# Altium schematic sheet Optic.SchDoc
size 420 x 297 mm; ENG_APP_DATE: --/--/--; DSN_APP_DATE: --/--/--; CHK_APP_DATE: --/--/--
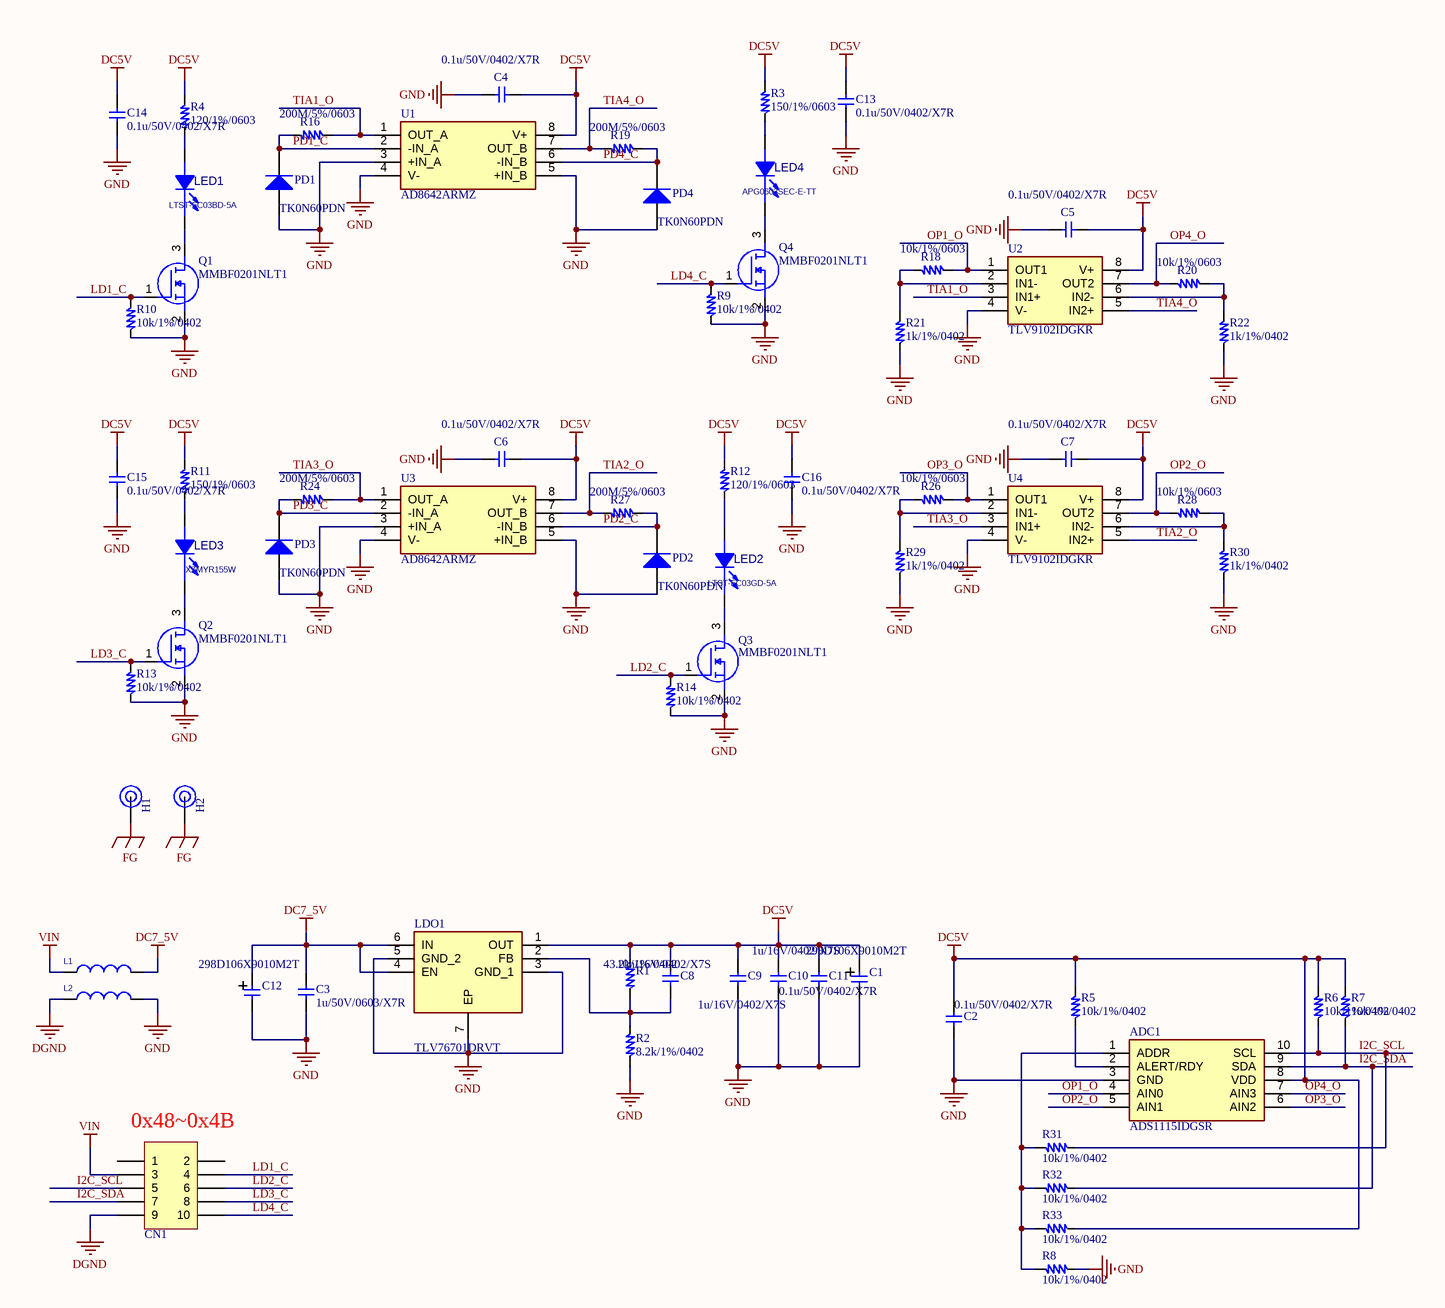
[diagram p0: Optic.SchDoc]

## Parts
ADC1  ADS1115IDGSR  [SOP50P490X110-10N]
C1  298D106X9010M2T  [CC0603]
C2  0.1u/50V/0402/X7R  [CC0402]
C3  1u/50V/0603/X7R  [CC0603]
C4  0.1u/50V/0402/X7R  [CC0402]
C5  0.1u/50V/0402/X7R  [CC0402]
C6  0.1u/50V/0402/X7R  [CC0402]
C7  0.1u/50V/0402/X7R  [CC0402]
C8  10n/16V/0402/X7S  [CC0402]
C9  1u/16V/0402/X7S  [CC0402]
C10  1u/16V/0402/X7S  [CC0402]
C11  0.1u/50V/0402/X7R  [CC0402]
C12  298D106X9010M2T  [CC0603]
C13  0.1u/50V/0402/X7R  [CC0402]
C14  0.1u/50V/0402/X7R  [CC0402]
C15  0.1u/50V/0402/X7R  [CC0402]
C16  0.1u/50V/0402/X7R  [CC0402]
CN1  320-10  [SHDR10W70P254_2X5_2000X850X900P]  (value not drawn)
H1  Screw_holes_3p5mm  [Screw_holes_2p3mm]  (value not drawn)  (no BOM)
H2  Screw_holes_3p5mm  [Screw_holes_2p3mm]  (value not drawn)  (no BOM)
L1  BLM21PG221SN1D  [CC0805]  (value not drawn)
L2  BLM21PG221SN1D  [CC0805]  (value not drawn)
LDO1  TLV76701DRVT  [SON65P200X200X80-7N]
LED1  LTST-FC03BD-5A  [LTST_FC03_LED]
LED2  LTST-FC03GD-5A  [LTST_FC03_LED]
LED3  XZMYR155W  [APG0603_LED]
LED4  APG0603SEC-E-TT  [APG0603_LED]
PD1  TK0N60PDN  [TK0N60PDN]
PD2  TK0N60PDN  [TK0N60PDN]
PD3  TK0N60PDN  [TK0N60PDN]
PD4  TK0N60PDN  [TK0N60PDN]
Q1  MMBF0201NLT1  [SOT65P210X110-3N]
Q2  MMBF0201NLT1  [SOT65P210X110-3N]
Q3  MMBF0201NLT1  [SOT65P210X110-3N]
Q4  MMBF0201NLT1  [SOT65P210X110-3N]
R1  43.2k/1%/0402  [CC0402_R]
R2  8.2k/1%/0402  [CC0402_R]
R3  150/1%/0603  [CC0603_R]
R4  120/1%/0603  [CC0603_R]
R5  10k/1%/0402  [CC0402_R]
R6  10k/1%/0402  [CC0402_R]
R7  10k/1%/0402  [CC0402_R]
R8  10k/1%/0402  [CC0402_R]
R9  10k/1%/0402  [CC0402_R]
R10  10k/1%/0402  [CC0402_R]
R11  150/1%/0603  [CC0603_R]
R12  120/1%/0603  [CC0603_R]
R13  10k/1%/0402  [CC0402_R]
R14  10k/1%/0402  [CC0402_R]
R16  200M/5%/0603  [CC0603_R]
R18  10k/1%/0603  [CC0603_R]
R19  200M/5%/0603  [CC0603_R]
R20  10k/1%/0603  [CC0603_R]
R21  1k/1%/0402  [CC0402_R]
R22  1k/1%/0402  [CC0402_R]
R24  200M/5%/0603  [CC0603_R]
R26  10k/1%/0603  [CC0603_R]
R27  200M/5%/0603  [CC0603_R]
R28  10k/1%/0603  [CC0603_R]
R29  1k/1%/0402  [CC0402_R]
R30  1k/1%/0402  [CC0402_R]
R31  10k/1%/0402  [CC0402_R]
R32  10k/1%/0402  [CC0402_R]
R33  10k/1%/0402  [CC0402_R]
U1  AD8642ARMZ  [SOP65P490X110-8N]
U2  TLV9102IDGKR  [SOP65P490X110-8N]
U3  AD8642ARMZ  [SOP65P490X110-8N]
U4  TLV9102IDGKR  [SOP65P490X110-8N]

## Nets
DC5V: ADC1.8(VDD) C1.2 C2.1 C4.2 C5.2 C6.2 C7.2 C8.1 C9.1 C10.1 C11.1 C13.2 C14.2 C15.2 C16.2 LDO1.1(OUT) R1.1 R3.2 R4.2 R5.2 R6.2 R7.2 R11.2 R12.2 R33.1 U1.8(V+) U2.8(V+) U3.8(V+) U4.8(V+)
DC7_5V: C3.1 C12.2 L1.2 LDO1.4(EN) LDO1.6(IN)
DGND: CN1.9 L2.1
FG: H1.1 H2.1
GND: ADC1.3(GND) C1.1 C2.2 C3.2 C4.1 C5.1 C6.1 C7.1 C9.2 C10.2 C11.2 C12.1 C13.1 C14.1 C15.1 C16.1 L2.2 LDO1.3(GND_1) LDO1.5(GND_2) LDO1.7(EP) PD1.2(A) PD2.2(A) PD3.2(A) PD4.2(A) Q1.2(S) Q2.2(S) Q3.2(S) Q4.2(S) R2.2 R8.1 R9.1 R10.1 R13.1 R14.1 R21.1 R22.1 R29.1 R30.1 U1.3(+IN_A) U1.4(V-) U1.5(+IN_B) U2.4(V-) U3.3(+IN_A) U3.4(V-) U3.5(+IN_B) U4.4(V-)
VIN: CN1.3 L1.1
I2C_SCL: ADC1.10(SCL) CN1.5 R6.1 R31.1
I2C_SDA: ADC1.9(SDA) CN1.7 R7.1 R32.1
LD1_C: CN1.4 Q1.1(G) R10.2
LD2_C: CN1.6 Q3.1(G) R14.2
LD3_C: CN1.8 Q2.1(G) R13.2
LD4_C: CN1.10 Q4.1(G) R9.2
OP1_O: ADC1.4(AIN0) R18.2 U2.1(OUT1)
OP2_O: ADC1.5(AIN1) R28.1 U4.7(OUT2)
OP3_O: ADC1.6(AIN2) R26.2 U4.1(OUT1)
OP4_O: ADC1.7(AIN3) R20.1 U2.7(OUT2)
PD1_C: PD1.1(K) R16.1 U1.2(-IN_A)
PD2_C: PD2.1(K) R27.2 U3.6(-IN_B)
PD3_C: PD3.1(K) R24.1 U3.2(-IN_A)
PD4_C: PD4.1(K) R19.2 U1.6(-IN_B)
TIA1_O: R16.2 U1.1(OUT_A) U2.3(IN1+)
TIA2_O: R27.1 U3.7(OUT_B) U4.5(IN2+)
TIA3_O: R24.2 U3.1(OUT_A) U4.3(IN1+)
TIA4_O: R19.1 U1.7(OUT_B) U2.5(IN2+)
NetADC1_1: ADC1.1(ADDR) R8.2 R31.2 R32.2 R33.2
NetADC1_2: ADC1.2(ALERT/RDY) R5.1
NetC8_2: C8.2 LDO1.2(FB) R1.2 R2.1
NetLED1_1: LED1.1(CATHODE) Q1.3(D)
NetLED1_2: LED1.2(ANODE) R4.1
NetLED2_1: LED2.1(CATHODE) Q3.3(D)
NetLED2_2: LED2.2(ANODE) R12.1
NetLED3_1: LED3.1(CATHODE) Q2.3(D)
NetLED3_2: LED3.2(ANODE) R11.1
NetLED4_1: LED4.1(CATHODE) Q4.3(D)
NetLED4_2: LED4.2(ANODE) R3.1
NetR18_1: R18.1 R21.2 U2.2(IN1-)
NetR20_2: R20.2 R22.2 U2.6(IN2-)
NetR26_1: R26.1 R29.2 U4.2(IN1-)
NetR28_2: R28.2 R30.2 U4.6(IN2-)

Not connected (* = marked no-connect by the designer): CN1 1 2

## Notes on the sheet
- (near CN1) 0x48~0x4B

## Library data of the parts
ADC1 = ADS1115IDGSR: 類比數位轉換器 - ADC 16B ADC w/ Int MUX PGA Comp Osc & Ref; Manufacturer_Name: Texas Instruments; Datasheet Link: http://www.ti.com/lit/gpn/ADS1115; Height: 1.1mm; Manufacturer_Part_Number: ADS1115IDGSR; Mouser Part Number: 595-ADS1115IDGSR; Mouser Price/Stock: https://www.mouser.co.uk/ProductDetail/Texas-Instruments/ADS1115IDGSR?qs=IK5e5L0zOXjKCJoVMhYO%2FQ%3D%3D; Arrow Part Number: ADS1115IDGSR; Arrow Price/Stock: https://www.arrow.com/en/products/ads1115idgsr/texas-instruments?region=nac
C1 C12 = 298D106X9010M2T: 鉭電容 - 固態 SMD 10uF 10volts 10% M case MAP
C2-C11 C13-C16 = CAP_MLCC
CN1 = 320-10: IDC_(100y) VER TH 10POS 2.54MM
H1 H2 = Screw_holes: Screw holes
L1 L2 = BLM21PG221SN1D: Ferrite Bead_220 ohm @ 100 MHz, 2 A, 0805
LDO1 = TLV76701DRVT: LDO電壓穩壓器 Adjustable- and fixed-output, 1-A, 16-V, positive-voltage low-dropout (LDO) linear regulator 6-WSON -40 to 125
LED1 = LTST-FC03BD-5A: 0.65 mm x 0.35 mm SMD LED, 0.2 mm thickness
LED2 = LTST-FC03GD-5A: 0.65 mm x 0.35 mm SMD LED, 0.2 mm thickness
LED3 = XZMYR155W: 0.65 mm x 0.35 mm SMD LED, 0.2 mm thickness
LED4 = APG0603SEC-E-TT: 0.65 mm x 0.35 mm SMD LED, 0.2 mm thickness
PD1-PD4 = TK0N60PDN: Si Photo-diode Chip
Q1-Q4 = MMBF0201NLT1: MOSFET (N-Channel)(百年)
R1-R14 R16 R18-R22 R24 R26-R33 = RES_SMD: RES_
U1 U3 = AD8642ARMZ: 精密放大器 DUAL LOW POWER/IBIAS, R-R JFET AMP; Manufacturer_Name: Analog Devices; Datasheet Link: https://datasheet.datasheetarchive.com/originals/distributors/Datasheets-SFU1/DSASFU10004012.pdf; Height: 1.1mm; Manufacturer_Part_Number: AD8642ARMZ; Mouser Part Number: 584-AD8642ARMZ; Mouser Price/Stock: https://www.mouser.co.uk/ProductDetail/Analog-Devices/AD8642ARMZ?qs=%2FtpEQrCGXCwJxihq4VIKpw%3D%3D; Arrow Part Number: AD8642ARMZ; Arrow Price/Stock: https://www.arrow.com/en/products/ad8642armz/analog-devices
U2 U4 = TLV9102IDGKR: 運算放大器 - 運放器; Manufacturer_Name: Texas Instruments; Datasheet Link: https://www.ti.com/lit/gpn/TLV9102; Height: 1.1mm; Manufacturer_Part_Number: TLV9102IDGKR; Mouser Part Number: 595-TLV9102IDGKR; Mouser Price/Stock: https://www.mouser.co.uk/ProductDetail/Texas-Instruments/TLV9102IDGKR?qs=Wj%2FVkw3K%252BMCOPWdrVsfgbw%3D%3D; Arrow Part Number: TLV9102IDGKR; Arrow Price/Stock: https://www.arrow.com/en/products/tlv9102idgkr/texas-instruments?region=nac